# Altium schematic sheet pt100.SchDoc
size A2
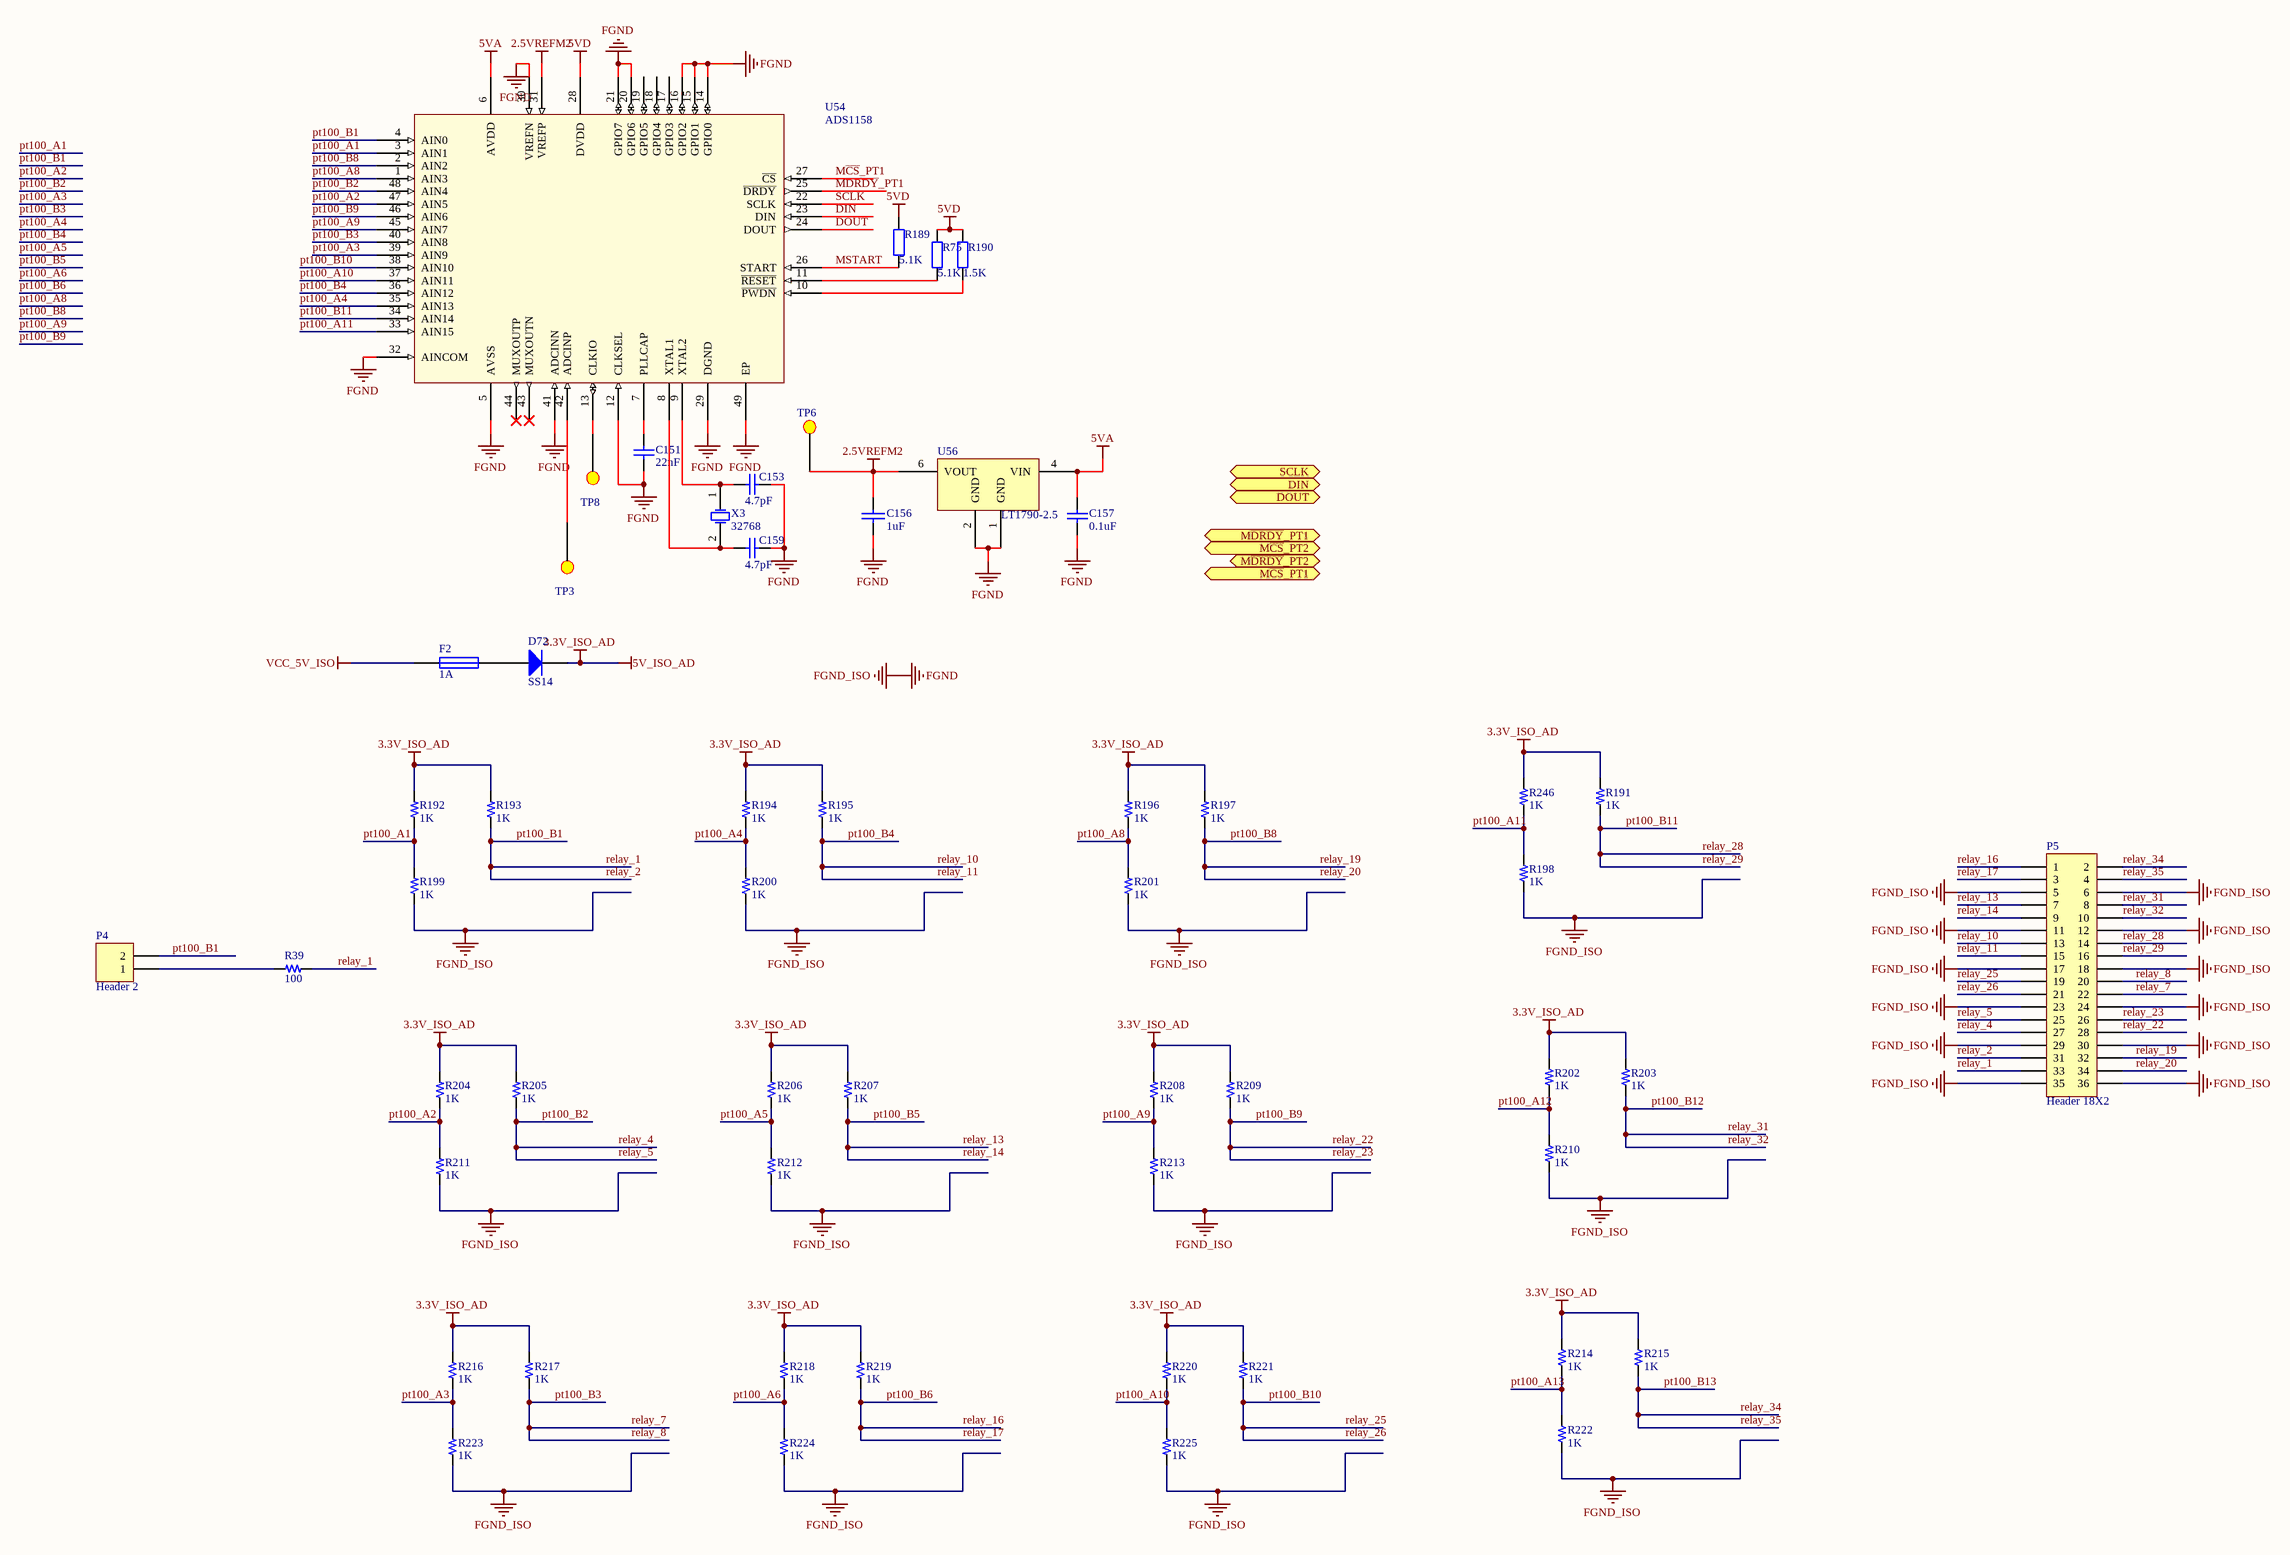
[diagram p0: pt100.SchDoc]

## Parts
C151  22nF  [0805C]
C153  4.7pF  [0603C]
C156  1uF  [0603C]
C157  0.1uF  [0603C]
C159  4.7pF  [0603C]
D72  SS14  [DO-214AC]
F2  1A  [0805r]
P4  Header 2  [HDR1X2]
P5  Header 18X2  [XH2.54_2x18]
R39  100  [0603R]
R75  5.1K  [0603R]
R189  5.1K  [0603R]
R190  1.5K  [0603R]
R191  1K  [0603R]
R192  1K  [0603R]
R193  1K  [0603R]
R194  1K  [0603R]
R195  1K  [0603R]
R196  1K  [0603R]
R197  1K  [0603R]
R198  1K  [0603R]
R199  1K  [0603R]
R200  1K  [0603R]
R201  1K  [0603R]
R202  1K  [0603R]
R203  1K  [0603R]
R204  1K  [0603R]
R205  1K  [0603R]
R206  1K  [0603R]
R207  1K  [0603R]
R208  1K  [0603R]
R209  1K  [0603R]
R210  1K  [0603R]
R211  1K  [0603R]
R212  1K  [0603R]
R213  1K  [0603R]
R214  1K  [0603R]
R215  1K  [0603R]
R216  1K  [0603R]
R217  1K  [0603R]
R218  1K  [0603R]
R219  1K  [0603R]
R220  1K  [0603R]
R221  1K  [0603R]
R222  1K  [0603R]
R223  1K  [0603R]
R224  1K  [0603R]
R225  1K  [0603R]
R246  1K  [0603R]
TP3  TEST_POINT  [TPD]  (value not drawn)
TP6  TEST_POINT  [TPD]  (value not drawn)
TP8  TEST_POINT  [TPD]  (value not drawn)
U54  ADS1158  [S-PVFQN-N48]
U56  LT1790-2.5  [SOT23-6]
X3  32768  [A]

## Ports
DIN (in), DOUT (out), M~{CS}_PT1 (out), M~{CS}_PT2 (out), M~{DRDY}_PT1 (out), M~{DRDY}_PT2 (out), SCLK (in)

## Nets
2.5VREFM2: C156.1 TP6.1 U54.31(VREFP) U56.6(VOUT)
3.3V_ISO_AD: D72.2(K) R191.2 R192.2 R193.2 R194.2 R195.2 R196.2 R197.2 R202.2 R203.2 R204.2 R205.2 R206.2 R207.2 R208.2 R209.2 R214.2 R215.2 R216.2 R217.2 R218.2 R219.2 R220.2 R221.2 R246.2  [also labelled 5V_ISO_AD]
5VA: C157.2 U54.6(AVDD) U56.4(VIN)
5VD: R75.1 R189.1 R190.1 U54.28(DVDD)
FGND: C151.2 C153.2 C156.2 C157.1 C159.2 P5.5 P5.6 P5.11 P5.12 P5.17 P5.18 P5.23 P5.24 P5.29 P5.30 P5.35 P5.36 R198.1 R199.1 R200.1 R201.1 R210.1 R211.1 R212.1 R213.1 R222.1 R223.1 R224.1 R225.1 U54.5(AVSS) U54.12(CLKSEL) U54.14(GPIO0) U54.15(GPIO1) U54.16(GPIO2) U54.20(GPIO6) U54.21(GPIO7) U54.29(DGND) U54.30(VREFN) U54.32(AINCOM) U54.41(ADCINN) U54.49(EP) U56.1(GND) U56.2(GND)  [also labelled FGND_ISO]
VCC_5V_ISO: F2.1
DIN: U54.23(DIN)
DOUT: U54.24(DOUT)
M~{CS}_PT1: U54.27(~{CS})
M~{DRDY}_PT1: U54.25(~{DRDY})
MSTART: R189.2 U54.26(START)
pt100_A1: R192.1 R199.2 U54.3(AIN1)
pt100_A2: R204.1 R211.2 U54.47(AIN5)
pt100_A3: R216.1 R223.2 U54.39(AIN9)
pt100_A4: R194.1 R200.2 U54.35(AIN13)
pt100_A5: R206.1 R212.2
pt100_A6: R218.1 R224.2
pt100_A8: R196.1 R201.2 U54.1(AIN3)
pt100_A9: R208.1 R213.2 U54.45(AIN7)
pt100_A10: R220.1 R225.2 U54.37(AIN11)
pt100_A11: R198.2 R246.1 U54.33(AIN15)
pt100_A12: R202.1 R210.2
pt100_A13: R214.1 R222.2
pt100_B1: P4.2 P5.31 P5.33 R39.1 R193.1 U54.4(AIN0)  [also labelled relay_1, relay_2]
pt100_B2: P5.25 P5.27 R205.1 U54.48(AIN4)  [also labelled relay_4, relay_5]
pt100_B3: P5.20 P5.22 R217.1 U54.40(AIN8)  [also labelled relay_7, relay_8]
pt100_B4: P5.13 P5.15 R195.1 U54.36(AIN12)  [also labelled relay_10, relay_11]
pt100_B5: P5.7 P5.9 R207.1  [also labelled relay_13, relay_14]
pt100_B6: P5.1 P5.3 R219.1  [also labelled relay_16, relay_17]
pt100_B8: P5.32 P5.34 R197.1 U54.2(AIN2)  [also labelled relay_19, relay_20]
pt100_B9: P5.26 P5.28 R209.1 U54.46(AIN6)  [also labelled relay_22, relay_23]
pt100_B10: P5.19 P5.21 R221.1 U54.38(AIN10)  [also labelled relay_25, relay_26]
pt100_B11: P5.14 P5.16 R191.1 U54.34(AIN14)  [also labelled relay_28, relay_29]
pt100_B12: P5.8 P5.10 R203.1  [also labelled relay_31, relay_32]
pt100_B13: P5.2 P5.4 R215.1  [also labelled relay_34, relay_35]
SCLK: U54.22(SCLK)
NetC151_1: C151.1 U54.7(PLLCAP)
NetC153_1: C153.1 U54.9(XTAL2) X3.1(OSC1)
NetC159_1: C159.1 U54.8(XTAL1) X3.2(OSC2)
NetD72_1: D72.1(A) F2.2
NetP4_1: P4.1 R39.2
NetR75_2: R75.2 U54.11(~{RESET})
NetR190_2: R190.2 U54.10(~{PWDN})
NetTP3_1: TP3.1 U54.42(ADCINP)
NetTP8_1: TP8.1 U54.13(CLKIO)

Not connected (* = marked no-connect by the designer): U54 17(GPIO3) 18(GPIO4) 19(GPIO5) 43(MUXOUTN)* 44(MUXOUTP)*; U56 3(DNC) 5(DNC)

## Library data of the parts
C151 C153 C157 = Cap: Capacitor; Published: 8-Jun-2000; LatestRevisionDate: 17-Jul-2002; LatestRevisionNote: Re-released for DXP Platform.; PackageReference: RAD-0.3; Publisher: Altium Limited; PackageDescription: Radial Cap, Thru-Hole; 2 Leads; 0.3 in Pin Spacing
  C157: Value: 0.1uF
C156 = CAP: Capacitor
C159 = Cap: Capacitor; Value: 6.8pF; Published: 8-Jun-2000; LatestRevisionDate: 17-Jul-2002; LatestRevisionNote: Re-released for DXP Platform.; PackageReference: RAD-0.3; Publisher: Altium Limited; PackageDescription: Radial Cap, Thru-Hole; 2 Leads; 0.3 in Pin Spacing
D72 = Diode: Default Diode; Published: 8-Jun-2000; LatestRevisionDate: 17-Jul-2002; LatestRevisionNote: Re-released for DXP Platform.; PackageVersion: Sep-1996; PackageReference: SMC; Publisher: Altium Limited; Code_JEDEC: DO-214-AB
F2 = Fuse 1: Fuse; Published: 8-Jun-2000; LatestRevisionDate: 17-Jul-2002; LatestRevisionNote: Re-released for DXP Platform.; PackageReference: PIN-W2/E2.8; Publisher: Altium Limited; PackageDescription: Thru-Hole; 2 Leads
P4 = Header 2: Header, 2-Pin; LatestRevisionDate: 17-Jul-2002; LatestRevisionNote: Re-released for DXP Platform.; Publisher: Altium Limited
P5 = Header 18X2: Header, 18-Pin, Dual row; LatestRevisionDate: 17-Jul-2002; LatestRevisionNote: Re-released for DXP Platform.; Publisher: Altium Limited
R39 R191-R225 R246 = R
R75 R189 R190 = Res0805M
U54 = ADS1158: 16-Channel, 16-Bit Analog-to-Digital Converter
U56 = LT1790-2.5: 2.5V Micropower SOT-23  Low Dropout Reference
X3 = XTAL: Crystal Oscillator; Published: 8-Jun-2000; LatestRevisionDate: 17-Jul-2002; LatestRevisionNote: Re-released for DXP Platform.; PackageReference: R38; Publisher: Altium Limited